# EAGLE design Synth_pcb_v2 (EAGLE 9.5.1)
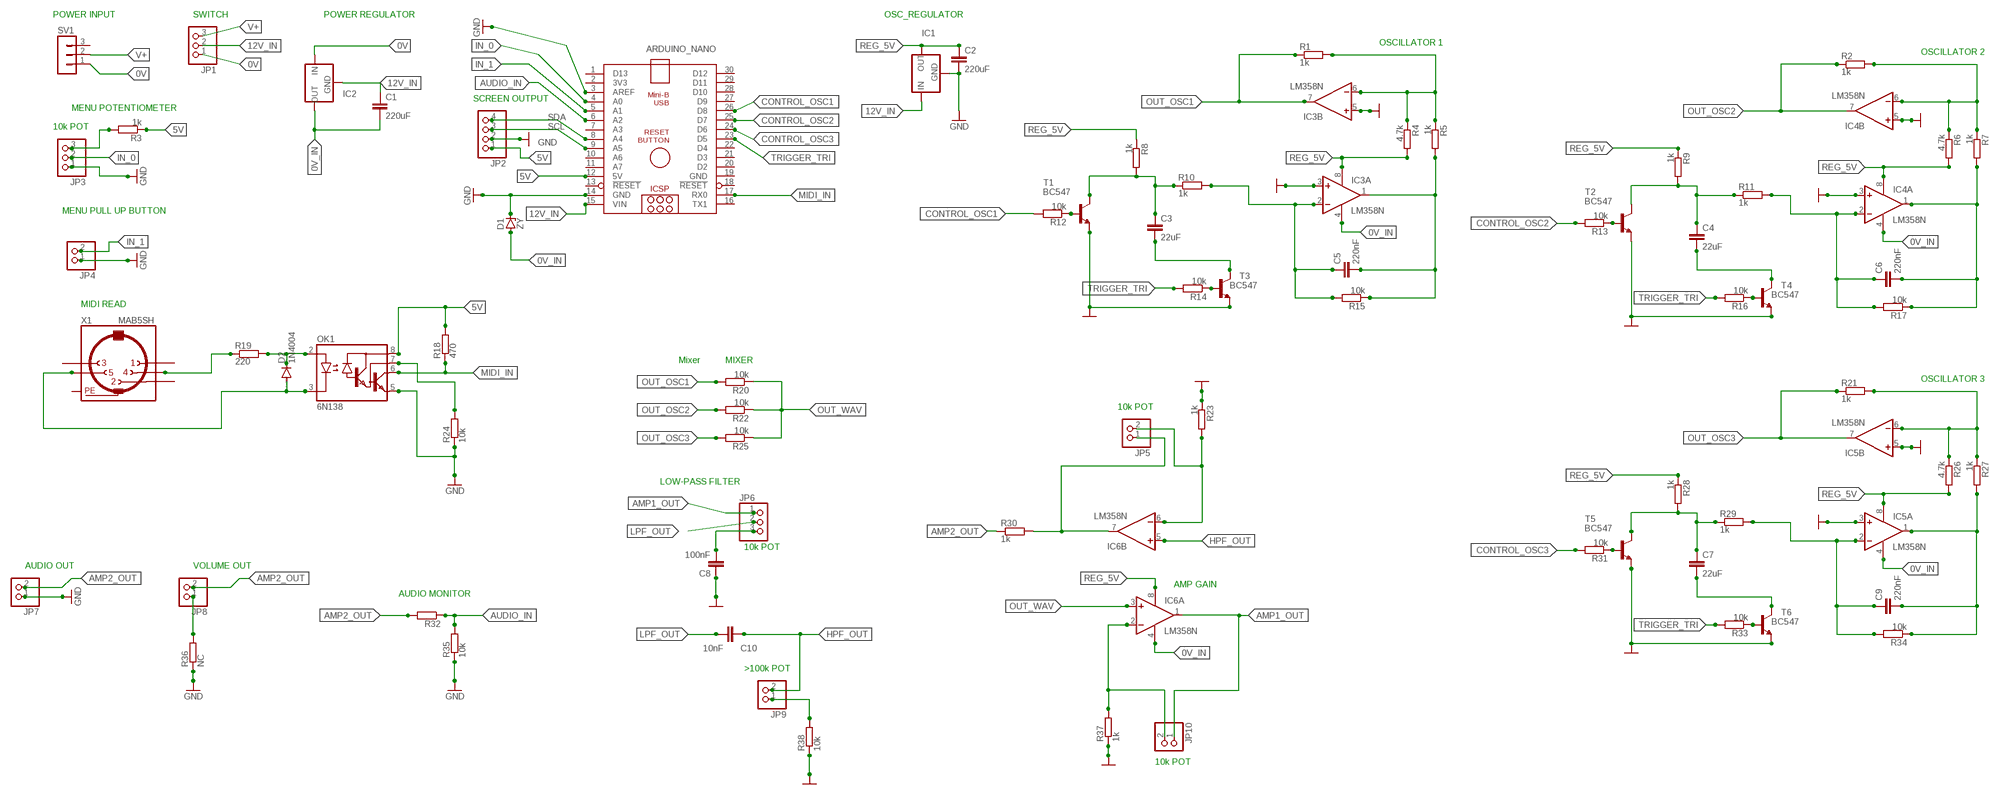
[diagram p0: schematic, sheet 1]

## Parts
ARDUINO_NANO  ARDUINO_NANO  [ARDUINO_NANO]
C1  220uF  C2,5-3  [C2.5-3]
C2  220uF  C2,5-3  [C2.5-3]
C3  22uF  C2,5-3  [C2.5-3]
C4  22uF  C2,5-3  [C2.5-3]
C5  220nF  C2,5-3  [C2.5-3]
C6  220nF  C2,5-3  [C2.5-3]
C7  22uF  C2,5-3  [C2.5-3]
C8  100nF  C2,5-3  [C2.5-3]
C9  220nF  C2,5-3  [C2.5-3]
C10  10nF  C2,5-3  [C2.5-3]
D1  ZY  [P1Z12]
D2  1N4004  [DO41-10]
IC1  78XXS  [78XXS]
IC2  79XXS  [79XXS]
IC3  LM358N  [DIL08]
IC4  LM358N  [DIL08]
IC5  LM358N  [DIL08]
IC6  LM358N  [DIL08]
JP1  PINHD-1X3  [1X03]
JP2  PINHD-1X4  [1X04]
JP3  PINHD-1X3  [1X03]
JP4  PINHD-1X2  [1X02]
JP5  PINHD-1X2  [1X02]
JP6  PINHD-1X3  [1X03]
JP7  PINHD-1X2  [1X02]
JP8  PINHD-1X2  [1X02]
JP9  PINHD-1X2  [1X02]
JP10  PINHD-1X2  [1X02]
OK1  6N138  [DIL08]
R1  1k  R-EU_0204/7  [0204/7]
R2  1k  R-EU_0204/7  [0204/7]
R3  1k  R-EU_0204/7  [0204/7]
R4  4.7k  R-EU_0204/7  [0204/7]
R5  1k  R-EU_0204/7  [0204/7]
R6  4.7k  R-EU_0204/7  [0204/7]
R7  1k  R-EU_0204/7  [0204/7]
R8  1k  R-EU_0204/7  [0204/7]
R9  1k  R-EU_0204/7  [0204/7]
R10  1k  R-EU_0204/7  [0204/7]
R11  1k  R-EU_0204/7  [0204/7]
R12  10k  R-EU_0204/7  [0204/7]
R13  10k  R-EU_0204/7  [0204/7]
R14  10k  R-EU_0204/7  [0204/7]
R15  10k  R-EU_0204/7  [0204/7]
R16  10k  R-EU_0204/7  [0204/7]
R17  10k  R-EU_0204/7  [0204/7]
R18  470  R-EU_0204/7  [0204/7]
R19  220  R-EU_0204/7  [0204/7]
R20  10k  R-EU_0204/7  [0204/7]
R21  1k  R-EU_0204/7  [0204/7]
R22  10k  R-EU_0204/7  [0204/7]
R23  1k  R-EU_0204/7  [0204/7]
R24  10k  R-EU_0204/7  [0204/7]
R25  10k  R-EU_0204/7  [0204/7]
R26  4.7k  R-EU_0204/7  [0204/7]
R27  1k  R-EU_0204/7  [0204/7]
R28  1k  R-EU_0204/7  [0204/7]
R29  1k  R-EU_0204/7  [0204/7]
R30  1k  R-EU_0204/7  [0204/7]
R31  10k  R-EU_0204/7  [0204/7]
R32  1k  R-EU_0204/7  [0204/7]
R33  10k  R-EU_0204/7  [0204/7]
R34  10k  R-EU_0204/7  [0204/7]
R35  10k  R-EU_0204/7  [0204/7]
R36  NC  R-EU_0204/7  [0204/7]
R37  1k  R-EU_0204/7  [0204/7]
R38  10k  R-EU_0204/7  [0204/7]
SV1  MA03-1  [MA03-1]
T1  BC547  [TO92]
T2  BC547  [TO92]
T3  BC547  [TO92]
T4  BC547  [TO92]
T5  BC547  [TO92]
T6  BC547  [TO92]
X1  MAB5SH  [MAB5SH]

## Nets
0V: IC2.IN JP1.1 SV1.1
0V_IN: C1.2 D1.A IC2.OUT IC3.4(P:V-) IC4.4(P:V-) IC5.4(P:V-) IC6.4(P:V-)
5V: ARDUINO_NANO.12(5V) JP2.1 OK1.8(VCC) R3.1 R18.2
12V_IN: ARDUINO_NANO.15(VIN) C1.1 IC1.IN IC2.GND JP1.2
AMP1_OUT: IC6.1(A:OUT) JP6.1 JP10.1
AMP2_OUT: JP7.2 JP8.2 R30.1 R32.2
AUDIO_IN: ARDUINO_NANO.6(A2) R32.1 R35.2
CONTROL_OSC1: ARDUINO_NANO.26(D8) R12.2
CONTROL_OSC2: ARDUINO_NANO.25(D7) R13.2
CONTROL_OSC3: ARDUINO_NANO.24(D6) R31.2
GND: ARDUINO_NANO.3(AREF) ARDUINO_NANO.14(GND) C2.2 C8.1 D1.C IC1.GND IC3.3(A:+IN) IC3.5(B:+IN) IC4.3(A:+IN) IC4.5(B:+IN) IC5.3(A:+IN) IC5.5(B:+IN) JP2.2 JP3.1 JP4.1 JP7.1 OK1.5(GND) R23.1 R24.1 R35.1 R36.1 R37.1 R38.1 T1.1(E) T2.1(E) T3.1(E) T4.1(E) T5.1(E) T6.1(E)
GND2: JP9.1 R38.2
HPF_OUT: C10.1 IC6.5(B:+IN) JP9.2
IN_0: ARDUINO_NANO.4(A0) JP3.2
IN_1: ARDUINO_NANO.5(A1) JP4.2
LPF_OUT: C10.2 JP6.2
MIDI_IN: ARDUINO_NANO.17(RX0) OK1.6(VO) R18.1
N$1: D2.A OK1.3(C) X1.5
N$2: IC6.7(B:OUT) JP5.1 R30.2
N$5: D2.C OK1.2(A) R19.2
N$6: R19.1 X1.4
N$7: OK1.7(VB) R24.2
N$11: C3.2 T3.3(C)
N$13: JP3.3 R3.2
N$16: C5.1 IC3.2(A:-IN) R10.2 R15.2
N$21: R12.1 T1.2(B)
N$22: R14.1 T3.2(B)
N$24: C3.1 R8.2 R10.1 T1.3(C)
N$25: C5.2 IC3.1(A:OUT) R5.2 R15.1
N$26: IC3.6(B:-IN) R1.2 R4.1 R5.1
N$29: C4.1 R9.2 R11.1 T2.3(C)
N$30: C4.2 T4.3(C)
N$33: C6.1 IC4.2(A:-IN) R11.2 R17.2
N$34: C6.2 IC4.1(A:OUT) R7.2 R17.1
N$35: IC4.6(B:-IN) R2.2 R6.1 R7.1
N$36: R13.1 T2.2(B)
N$37: R16.1 T4.2(B)
N$40: C7.1 R28.2 R29.1 T5.3(C)
N$41: C7.2 T6.3(C)
N$44: C9.1 IC5.2(A:-IN) R29.2 R34.2
N$45: C9.2 IC5.1(A:OUT) R27.2 R34.1
N$46: IC5.6(B:-IN) R21.2 R26.1 R27.1
N$47: R31.1 T5.2(B)
N$48: R33.1 T6.2(B)
N$57: IC6.6(B:-IN) JP5.2 R23.2
N$58: IC6.2(A:-IN) JP10.2 R37.2
N$59: C8.2 JP6.3
N$63: JP8.1 R36.2
OUT_OSC1: IC3.7(B:OUT) R1.1 R20.2
OUT_OSC2: IC4.7(B:OUT) R2.1 R22.2
OUT_OSC3: IC5.7(B:OUT) R21.1 R25.2
OUT_WAV: IC6.3(A:+IN) R20.1 R22.1 R25.1
REG_5V: C2.1 IC1.OUT IC3.8(P:V+) IC4.8(P:V+) IC5.8(P:V+) IC6.8(P:V+) R4.2 R6.2 R8.1 R9.1 R26.2 R28.1
SCL: ARDUINO_NANO.9(A5) JP2.3
SDA: ARDUINO_NANO.8(A4) JP2.4
TRIGGER_TRI: ARDUINO_NANO.23(D5) R14.2 R16.2 R33.2
V+: JP1.3 SV1.2
Unconnected: ARDUINO_NANO.1(D13) ARDUINO_NANO.2(3V3) ARDUINO_NANO.7(A3) ARDUINO_NANO.10(A6) ARDUINO_NANO.11(A7) ARDUINO_NANO.13(!RESET) ARDUINO_NANO.16(TX1) ARDUINO_NANO.18(!RESET) ARDUINO_NANO.20(D2) ARDUINO_NANO.21(D3) ARDUINO_NANO.22(D4) ARDUINO_NANO.27(D9) ARDUINO_NANO.28(D10) ARDUINO_NANO.29(D11) ARDUINO_NANO.30(D12) SV1.3 X1.1 X1.2 X1.3

## Notes on the sheet
- POWER INPUT | SWITCH | POWER REGULATOR | OSC_REGULATOR
- OSCILLATOR 1
- OSCILLATOR 2
- SCREEN OUTPUT
- MENU POTENTIOMETER
- 10k POT
- MENU PULL UP BUTTON
- MIDI READ
- Mixer | MIXER
- OSCILLATOR 3
- 10k POT
- LOW-PASS FILTER
- 10k POT
- AUDIO OUT | VOLUME OUT
- AMP GAIN
- AUDIO MONITOR
- >100k POT
- 10k POT

## Power pins joined to a net without a drawn wire
GND: ARDUINO_NANO.19(GND)
PE: X1.PE X1.PE@(PE)

## Library data of the parts
ARDUINO_NANO = ArduinoNanoV30:ARDUINO_NANO: Arduino Nano V3.0 Overview: The Arduino Nano is a small, complete, and breadboard-friendly board based on the ATmega328 (Arduino Nano 3.x) or ATmega168 (Arduino Nano 2.x). It has more or less the same functionality of the Arduino Duemilanove, but in a different package. It lacks only a DC power jack, and works with a Mini-B USB cable instead of a standard one. The Nano was designed and is being produced by Gravitech. Specifications: Microcontroller Atmel ATmega168 or ATmega328 Operating Voltage (logic level) 5 V Input Voltage (recommended) 7-12 V Input Voltage (limits) 6-20 V Digital I/O Pins 14 (of which 6 provide PWM output) Analog Input Pins 8 DC Current per I/O Pin 40 mA Flash Memory 16 KB (ATmega168) or 32 KB (ATmega328) of which 2 KB used by bootloader SRAM 1 KB (ATmega168) or 2 KB (ATmega328) EEPROM 512 bytes (ATmega168) or 1 KB (ATmega328) Clock Speed 16 MHz Dimensions 0.73" x 1.70" Length 45 mm Width 18 mm Weigth 5 g Power: The Arduino Nano can be powered via the Mini-B USB connection, 6-20V unregulated external power supply (pin 30), or 5V regulated external power supply (pin 27). The power source is automatically selected to the highest voltage source. Memory: The ATmega168 has 16 KB of flash memory for storing code (of which 2 KB is used for the bootloader); the ATmega328 has 32 KB, (also with 2 KB used for the bootloader). The ATmega168 has 1 KB of SRAM and 512 bytes of EEPROM (which can be read and written with the EEPROM library); the ATmega328 has 2 KB of SRAM and 1 KB of EEPROM. Input and Output: Each of the 14 digital pins on the Nano can be used as an input or output, using pinMode(), digitalWrite(), and digitalRead() functions. They operate at 5 volts. Each pin can provide or receive a maximum of 40 mA and has an internal pull-up resistor (disconnected by default) of 20-50 kOhms. In addition, some pins have specialized functions. Visit Arduino - ArduinoBoardNano <https://www.arduino.cc/en/Main/ArduinoBoardNano>
C1-C10 = capacitor-wima:C: CAPACITOR naming: grid - package width
D1 = diode:ZY: Z DIODE
D2 = diode:1N4004: DIODE general purpose rectifier, 1 A
IC1 = v-reg:78XXS: VOLTAGE REGULATOR
IC2 = v-reg:79XXS: VOLTAGE REGULATOR
IC3-IC6 = linear:LM358: OP AMP also LM158; LM258; LM2904 Source: http://cache.national.com/ds/LM/LM158.pdf
JP1 JP3 JP6 = pinhead:PINHD-1X3: PIN HEADER
JP2 = pinhead:PINHD-1X4: PIN HEADER
JP4 JP5 JP7-JP10 = pinhead:PINHD-1X2: PIN HEADER
OK1 = optocoupler:6N138: MOTOROLA OPTO COUPLER; MF: VISHAY/TELEFUNKEN; MPN: 6N138; OC_FARNELL: 9860150; OC_NEWARK: 35K5294
R1-R38 = rcl:R-EU_: RESISTOR, European symbol; SPICEPREFIX: R
SV1 = con-lstb:MA03-1: PIN HEADER; OC_FARNELL: unknown; OC_NEWARK: unknown
T1-T6 = transistor:BC547: NPN TRANSISTOR
X1 = con-hirschmann_alt:MAB5SH: Female CONNECTOR 5 pins 90 deg. with shield, horizontal (DIN 41524); OC_FARNELL: 809883; OC_NEWARK: unknown

## Board
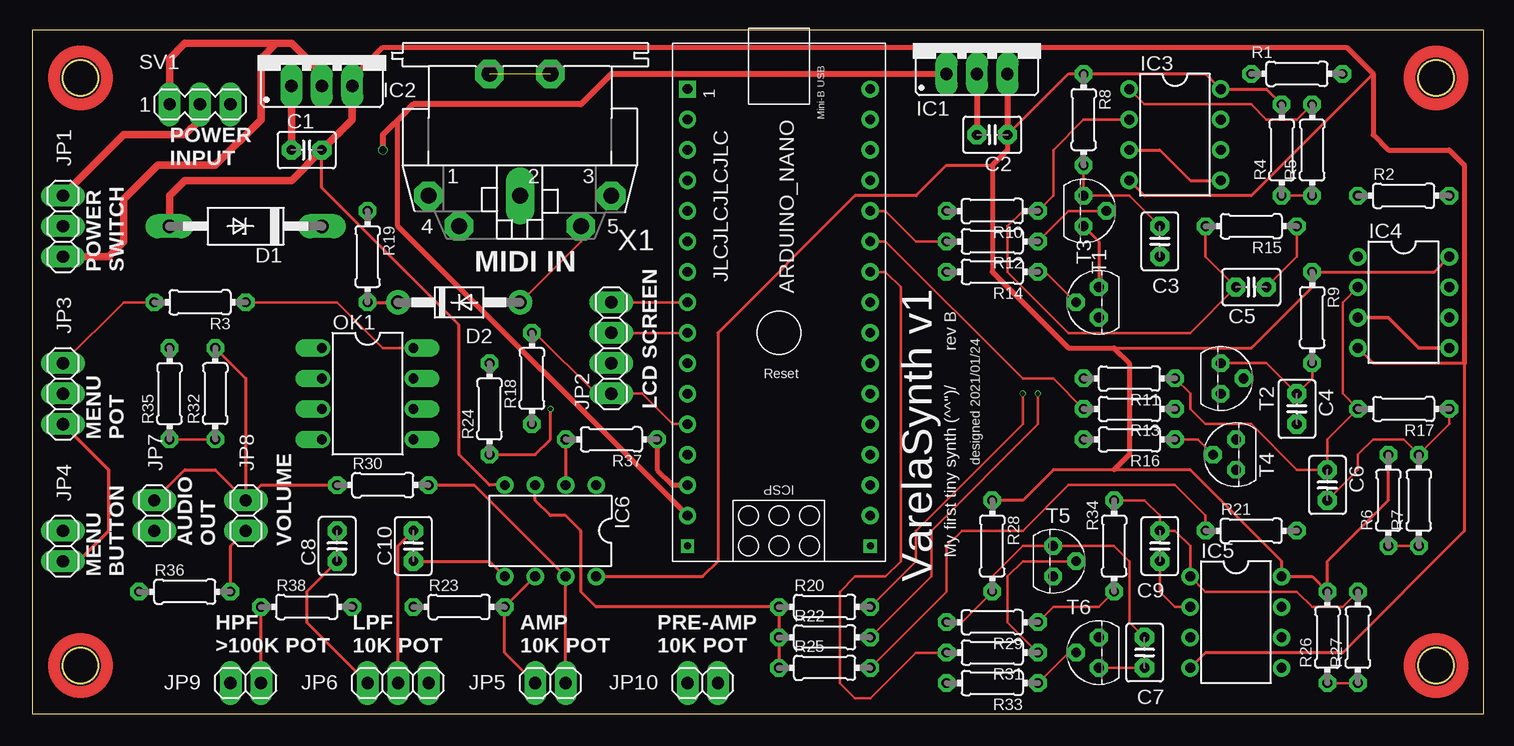
[diagram p1: board, top side]
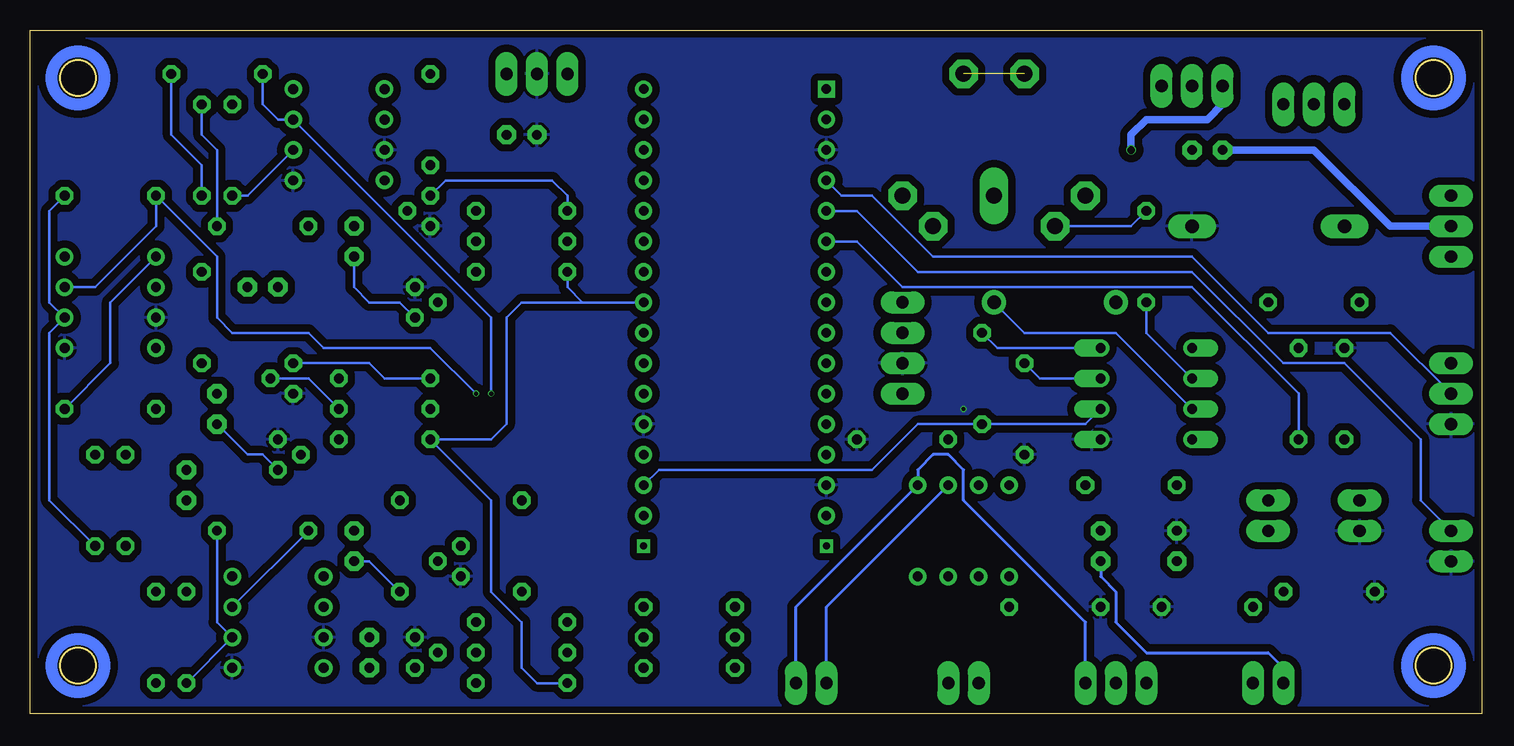
[diagram p2: board, bottom side, seen from below]

Size 121 x 57 mm. Coordinates in mm from the lower left corner, seen from the top.
Outline: 0,0 121,0 121,57 0,57 0,0
Outline: circle at 4,53 radius 1.5
Outline: circle at 4,4 radius 1.5
Outline: circle at 117,4 radius 1.5
Outline: circle at 117,53 radius 1.5
Copper layers (1*16): Top 0.035mm / dielectric 1.6mm / Bottom 0.035mm
Design rules "jlcpcb-2layers": minimum track width 5mil, minimum drill 0.3mm, track to track 5mil, track to pad 5mil, pad to pad 5mil, via to via 5mil, smd to smd 5mil, copper to edge 0.2mm, drill to drill 6mil, minimum pad ring 10mil, minimum via ring 3mil, stop-mask expansion 4mil, vias tented up to drill 0mil, thermal gap 10mil

### Footprints (pad centres in the part's own frame; a part is rotated, then mirrored left to right if it is on the bottom)
ARDUINO_NANO = drill 0.8 square: 1 -20.32,-7.62 | drill 0.8: 2 -17.78,-7.62; 3 -15.24,-7.62; 4 -12.7,-7.62; 5 -10.16,-7.62; 6 -7.62,-7.62; 7 -5.08,-7.62; 8 -2.54,-7.62; 9 0,-7.62; 10 2.54,-7.62; 11 5.08,-7.62; 12 7.62,-7.62; 13 10.16,-7.62; 14 12.7,-7.62; 15 15.24,-7.62; 16 15.24,7.62; 17 12.7,7.62; 18 10.16,7.62; 19 7.62,7.62; 20 5.08,7.62; 21 2.54,7.62; 22 0,7.62; 23 -2.54,7.62; 24 -5.08,7.62; 25 -7.62,7.62; 26 -10.16,7.62; 27 -12.7,7.62; 28 -15.24,7.62; 29 -17.78,7.62; 30 -20.32,7.62 | drill 0.6 square: P$1 17.78,-7.62; P$2 17.78,7.62
C2.5-3 = drill 0.813 pad 1.6 octagon: 1 -1.27,0; 2 1.27,0
P1Z12 = drill 1.118 long: A 6.35,0; C -6.35,0
DO41-10 = drill 1.118: A 5.08,0; C -5.08,0
78XXS = drill 1.016 long: GND 0,-2.54; IN -2.54,-2.54; OUT 2.54,-2.54
79XXS = drill 1.016 long: GND -2.54,-2.54; IN 0,-2.54; OUT 2.54,-2.54
DIL08 = drill 0.813 pad 1.27: 1 -3.81,-3.81; 2 -1.27,-3.81; 3 1.27,-3.81; 4 3.81,-3.81; 5 3.81,3.81; 6 1.27,3.81; 7 -1.27,3.81; 8 -3.81,3.81
1X03 = drill 1.016 long: 1 -2.54,0; 2 0,0; 3 2.54,0
1X04 = drill 1.016 long: 1 -3.81,0; 2 -1.27,0; 3 1.27,0; 4 3.81,0
1X02 = drill 1.016 long: 1 -1.27,0; 2 1.27,0
DIL08' = drill 0.813 offset: 1 -3.81,-3.81; 2 -1.27,-3.81; 3 1.27,-3.81; 4 3.81,-3.81; 5 3.81,3.81; 6 1.27,3.81; 7 -1.27,3.81; 8 -3.81,3.81
0204/7 = drill 0.813 octagon: 1 -3.81,0; 2 3.81,0
MA03-1 = drill 1.016 long: 1 -2.54,0; 2 0,0; 3 2.54,0
TO92 = drill 0.813 octagon: 1 1.27,0; 2 0,1.905; 3 -1.27,0
MAB5SH = drill 1.321 octagon: 1 7.62,5.08; 3 -7.62,5.08; 4 5.08,7.62; 5 -5.08,7.62; PE -2.54,-5.08; PE@ 2.54,-5.08 | drill 1.321 long: 2 0,5.08

### Placement (x,y rotation side)
ARDUINO_NANO  62.23,31.75 270 top
C1  22.86,46.99 0 top
C2  80.01,48.26 180 top
C3  93.98,39.37 270 top
C4  105.41,25.4 270 top
C5  101.6,35.56 0 top
C6  107.95,19.05 270 top
C7  92.71,5.08 270 top
C8  25.4,13.97 270 top
C9  93.98,13.97 90 top
C10  31.75,13.97 90 top
D1  17.78,40.64 180 top
D2  35.56,34.29 0 top
IC1  78.74,55.88 0 top
IC2  24.13,54.88 0 top
IC3  95.25,48.26 270 top
IC4  114.3,34.29 270 top
IC5  100.33,7.62 270 top
IC6  43.18,15.24 180 top
JP1  2.54,40.64 90 top
JP2  48.26,30.48 90 top
JP3  2.54,26.67 90 top
JP4  2.54,13.97 90 top
JP5  43.18,2.54 180 top
JP6  30.48,2.54 180 top
JP7  10.16,16.51 90 top
JP8  17.78,16.51 90 top
JP9  17.78,2.54 180 top
JP10  55.88,2.54 180 top
OK1  6N138  [DIL08']  27.94,26.67 270 top
R1  105.41,53.34 0 top
R2  114.3,43.18 0 top
R3  13.97,34.29 180 top
R4  104.14,46.99 90 top
R5  106.68,46.99 90 top
R6  113.03,17.78 90 top
R7  115.57,17.78 90 top
R8  87.63,49.53 270 top
R9  106.68,33.02 270 top
R10  80.01,41.91 0 top
R11  91.44,27.94 0 top
R12  80.01,39.37 180 top
R13  91.44,25.4 180 top
R14  80.01,36.83 180 top
R15  101.6,40.64 180 top
R16  91.44,22.86 180 top
R17  114.3,25.4 180 top
R18  41.64,27.94 90 top
R19  27.94,38.1 270 top
R20  66.04,8.89 0 top
R21  101.6,15.24 0 top
R22  66.04,6.35 0 top
R23  35.56,8.89 0 top
R24  38.1,25.4 90 top
R25  66.04,3.81 0 top
R26  107.95,6.35 90 top
R27  110.49,6.35 90 top
R28  80.01,13.97 270 top
R29  80.01,7.62 0 top
R30  29.21,19.05 0 top
R31  80.01,5.08 180 top
R32  15.24,26.67 90 top
R33  80.01,2.54 180 top
R34  90.17,13.97 270 top
R35  11.43,26.67 270 top
R36  12.7,10.16 0 top
R37  48.26,22.86 180 top
R38  22.86,8.89 180 top
SV1  13.97,50.8 0 top
T1  87.63,41.91 270 top
T2  99.06,27.94 270 top
T3  88.9,34.29 90 top
T4  100.33,21.59 90 top
T5  85.09,12.7 270 top
T6  88.9,5.08 90 top
X1  40.64,48.26 180 top

### Tracks (layer width: path | path; a pad name or v marks a point on that pad's centre or on a via)
0V
  Top 0.61: IC2.IN 24.13,53.34 21.59,55.88 20.32,55.88 | JP1.1 6.35,38.1 7.62,39.37 7.62,42.9 10.44,45.72 15.24,45.72 19.05,49.53 19.05,54.61 20.32,55.88 | SV1.1 11.43,54.61 12.7,55.88 20.32,55.88
0V_IN
  Top 0.254: IC3.4 92.71,43.18 101.6,43.18 111.76,53.34 | IC4.4 111.76,29.21 119.36,29.21 119.36,15.22 109.22,5.08 97.79,5.08 IC5.4 | IC6.4 38.1,19.05 35.56,21.59 35.56,32.41 24.13,43.84 C1.2
  Top 0.406: 119.36,29.21 119.36,45.72 118.09,46.99 113.03,46.99 111.76,48.26 111.76,53.34 109.55,55.55 29.21,55.55 26.67,53.01 IC2.OUT
  Top 0.61: D1.A 11.43,43.18 12.7,44.45 21.59,44.45 C1.2 26.67,49.53 IC2.OUT
5V
  Top 0.203: ARDUINO_NANO.12 53.34,24.13 50.8,26.67 JP2.1 46.99,26.67 41.91,31.75 R18.2 | R3.1 25.4,34.29 29.21,30.48 OK1.8
  Bottom 0.203: R18.2 40.37,30.48 OK1.8
12V_IN  (via drill 0.65)
  Top 0.305: 30.45,49.51 31.11,50.16
  Top 0.406: ARDUINO_NANO.15 30.45,40.66 30.45,49.51
  Top 0.508: IC1.IN 48.26,53.34 45.72,50.8 31.75,50.8 31.11,50.16 29.21,48.26 v29.21,46.99
  Top 0.61: C1.1 IC2.GND
  Bottom 0.61: C1.1 13.97,46.99 7.62,40.64 JP1.2 | IC2.GND 21.59,50.8 22.86,49.53 27.94,49.53 29.21,48.26 v29.21,46.99
AMP1_OUT
  Bottom 0.254: JP10.1 57.15,8.89 IC6.1 46.99,20.32 45.72,21.59 44.45,21.59 43.18,20.32 43.18,17.78 33.02,7.62 JP6.1
AMP2_OUT
  Top 0.254: JP8.2 19.05,19.05 R30.1 | JP8.2 15.24,20.32 12.7,20.32 JP7.2 | R32.2 17.78,27.94 JP8.2
AUDIO_IN
  Top 0.203: R32.1 R35.2
  Bottom 0.203: ARDUINO_NANO.6 52.07,39.37 48.26,35.56 24.13,35.56 15.24,26.67 R32.1
CONTROL_OSC1
  Top 0.203: ARDUINO_NANO.26 71.12,41.91 73.66,39.37 R12.2
CONTROL_OSC2
  Top 0.203: ARDUINO_NANO.25 71.12,39.37 82.55,27.94 85.09,27.94 R13.2
CONTROL_OSC3
  Top 0.203: ARDUINO_NANO.24 71.12,36.83 72.39,35.56 72.39,12.7 71.12,11.43 68.58,11.43 67.31,10.16 67.31,2.54 68.58,1.27 69.85,1.27 73.66,5.08 R31.2
GND  (via drill 0.35)
  Top 0.254: T1.1 88.9,39.37 T3.1 | IC3.3 93.98,46.99 96.52,44.45 IC3.5 | R24.1 41.91,21.59 43.18,22.86 v43.18,25.4
  Top 0.305: IC4.3 113.03,33.02 115.57,30.48 IC4.5 | JP3.1 6.35,20.32 6.35,15.24 3.81,12.7 JP4.1
  Top 0.406: R37.1 52.07,20.32 53.34,19.05 ARDUINO_NANO.14
  Top 0.508: IC1.GND C2.2
  pour Bottom (isolate 0.61): -4,61 -4,0 2,-6 115,-6 132,11 132,53 122,63 -2,63
GND2
  Top 0.254: JP9.1 R38.2
HPF_OUT
  Top 0.254: C10.1 38.1,12.7 IC6.5
  Bottom 0.254: C10.1 31.75,11.43 30.48,10.16 30.48,7.62 27.94,5.08 17.78,5.08 16.51,3.81 JP9.2
IN_0
  Bottom 0.203: ARDUINO_NANO.4 53.34,43.18 50.8,43.18 45.72,38.1 24.13,38.1 17.78,31.75 7.62,31.75 JP3.2
IN_1
  Bottom 0.203: ARDUINO_NANO.5 52.07,41.91 46.99,36.83 24.13,36.83 16.51,29.21 11.43,29.21 5.08,22.86 5.08,17.78 JP4.2
LPF_OUT
  Top 0.254: JP6.2 30.48,13.97 C10.2
MIDI_IN
  Bottom 0.203: ARDUINO_NANO.17 68.58,20.32 50.8,20.32 46.99,24.13 R18.1 33.02,24.13 OK1.6
N$1
  Top 0.203: D2.A 45.72,39.37 X1.5
  Bottom 0.203: D2.A 38.1,31.75 30.48,31.75 OK1.3
N$2
  Top 0.254: JP5.1 IC6.7 36.83,19.05 R30.2
N$5
  Top 0.254: R19.2 D2.C
  Bottom 0.203: OK1.2 27.94,31.75 R19.2
N$6
  Bottom 0.203: X1.4 29.21,40.64 R19.1
N$7
  Bottom 0.203: OK1.7 36.83,27.94 R24.2
N$11
  Bottom 0.203: T3.3 90.17,34.29 92.71,34.29 93.98,35.56 C3.2
N$13
  Top 0.203: JP3.3 7.62,34.29 R3.2
N$16
  Top 0.203: IC3.2 87.63,49.53 85.09,46.99 85.09,43.18 R10.2 82.55,41.91 81.28,40.64 81.28,36.83 86.36,31.75 96.52,31.75 C5.1 97.79,38.1 R15.2
N$21
  Top 0.203: R12.1 86.36,41.91 T1.2
N$22
  Top 0.203: R14.1 84.45,36.83 T3.2
N$24
  Top 0.203: R8.2 T1.3 91.44,43.18 C3.1
  Bottom 0.203: R10.1 76.2,43.18 77.47,44.45 86.36,44.45 T1.3
N$25
  Top 0.203: R5.2 105.41,49.53 102.87,49.53 101.6,50.8 92.71,50.8 IC3.1 | R15.1 105.41,38.1 C5.2
  Bottom 0.203: R15.1 105.41,46.99 106.68,48.26 R5.2
N$26
  Top 0.203: R4.1 R5.1
  Bottom 0.203: R4.1 102.87,43.18 IC3.6 | R5.1 106.68,45.72 109.22,48.26 R1.2
N$29
  Top 0.203: R9.2 106.68,27.94 C4.1 102.87,29.21 T2.3
  Bottom 0.203: R11.1 91.44,27.94 92.71,29.21 T2.3
N$30
  Bottom 0.203: T4.3 101.6,21.59 102.87,21.59 C4.2
N$33
  Top 0.203: IC4.2 109.22,34.29 109.22,26.67 R17.2 107.95,22.86 C6.1 105.41,20.32 101.6,24.13 97.79,24.13 96.52,25.4 96.52,26.67 R11.2
N$34
  Top 0.203: R17.1 118.11,24.13 R7.2 114.3,22.86 111.76,22.86 110.49,21.59 110.49,20.32 C6.2
  Bottom 0.203: R17.1 114.3,29.21 114.3,34.29 IC4.1
N$35
  Top 0.203: R6.1 R7.1
  Bottom 0.203: R2.2 119.38,41.91 119.38,34.29 IC4.6 119.38,31.75 119.38,17.78 R7.1
N$36
  Bottom 0.203: R13.1 97.79,27.94 T2.2
N$37
  Top 0.203: R16.1 97.16,22.86 T4.2
N$40
  Top 0.203: R29.1 77.47,7.62 R28.2 80.01,11.43 82.55,13.97 T5.3 90.17,13.97 91.44,12.7 91.44,7.62 C7.1
N$41
  Top 0.203: T6.3 C7.2
N$44
  Top 0.203: R29.2 85.09,8.89 88.9,8.89 R34.2 | C9.1 93.98,10.16 95.25,8.89 IC5.2
  Bottom 0.203: R34.2 92.71,12.7 C9.1
N$45
  Top 0.203: R27.2 109.22,8.89 106.68,8.89 105.41,10.16 97.79,10.16 IC5.1 96.52,13.97 95.25,15.24 C9.2 93.98,16.51 92.71,17.78 R34.1
N$46
  Top 0.203: R27.1 R26.1
  Bottom 0.203: R21.2 105.41,7.62 IC5.6 R26.1
N$47
  Top 0.203: T5.2 82.55,12.7 81.28,11.43 81.28,7.62 R31.1
N$48
  Top 0.203: T6.2 86.36,5.08 R33.1
N$57
  Top 0.254: JP5.2 39.37,5.08 R23.2 IC6.6
N$58
  Top 0.254: R37.2 IC6.2
  Bottom 0.254: JP10.2 54.61,8.89 IC6.2
N$59
  Top 0.254: JP6.3 22.86,7.62 22.86,10.16 C8.2
N$63
  Top 0.254: R36.2 16.51,13.97 JP8.1
OUT_OSC1  (via drill 0.35)
  Top 0.203: R20.2 73.66,12.7 73.66,15.24 82.55,24.13 v82.55,26.67
  Bottom 0.203: v82.55,26.67 82.55,33.02 IC3.7 100.33,49.53 101.6,50.8 R1.1
OUT_OSC2  (via drill 0.35)
  Top 0.203: R22.2 74.93,11.43 74.93,15.24 83.82,24.13 v83.82,26.67
  Bottom 0.203: v83.82,26.67 87.63,30.48 96.52,30.48 97.79,31.75 104.14,31.75 105.41,33.02 105.41,38.1 R2.1 110.49,40.64 115.57,35.56 IC4.7
OUT_OSC3
  Top 0.203: R25.2 76.2,10.16 76.2,13.97 77.47,15.24 82.55,15.24 86.36,19.05 95.25,19.05 97.79,16.51 R21.1
  Bottom 0.203: IC5.7 R21.1
OUT_WAV
  Top 0.254: IC6.3 41.91,17.78 43.18,16.51 44.45,16.51 45.72,15.24 45.72,10.16 46.99,8.89 R20.1 R22.1 R25.1
PE  (1 unrouted)
REG_5V
  Top 0.254: C2.1 86.36,53.34 R8.1 97.79,53.34 IC3.8 102.87,52.07 R4.2 | R28.1 82.55,17.78 85.09,20.32 90.17,20.32 96.52,20.32 104.14,12.7 IC5.8 106.68,11.43 R26.2 107.95,12.7 113.03,17.78 R6.2 | IC4.8 116.84,36.83 R9.1 106.68,35.56 101.6,30.48 90.17,30.48 | IC6.8 55.88,11.43 57.15,12.7 57.15,31.75 68.58,43.18 73.66,43.18 76.2,45.72 80.01,45.72
  Top 0.406: C2.1 81.28,46.99 80.01,45.72 80.01,36.83 86.36,30.48 90.17,30.48 91.44,29.21 91.44,21.59 90.17,20.32
  Top 0.508: IC1.OUT C2.1
SCL
  Top 0.203: JP2.3 ARDUINO_NANO.9
SDA
  Top 0.203: JP2.4 ARDUINO_NANO.8
TRIGGER_TRI
  Bottom 0.203: ARDUINO_NANO.23 74.93,34.29 | 74.93,34.29 76.2,35.56 R14.2 | 74.93,34.29 80.01,34.29 81.28,33.02 81.28,24.13 82.55,22.86 R16.2 82.55,17.78 82.55,10.16 80.01,7.62 80.01,3.81 78.74,2.54 R33.2
V+
  Top 0.61: JP1.3 7.62,48.26 11.43,48.26 12.7,48.26 13.97,49.53 SV1.2
(copper drawn outside any net)
  shapes: Bottom circle x4, Top circle x4

### Text on the board
tNames: POWER / INPUT | POWER / SWITCH | MIDI IN | JLCJLCJLCJLC | rev B | LCD SCREEN | MENU / POT | designed 2021/01/24 | AUDIO / OUT | VOLUME | My first tiny synth (^^")/ | MENU / BUTTON | VarelaSynth v1 | HPF / >100K POT | LPF / 10K POT | AMP / 10K POT | PRE-AMP / 10K POT